# EAGLE schematic kotel (EAGLE 7.7.0)
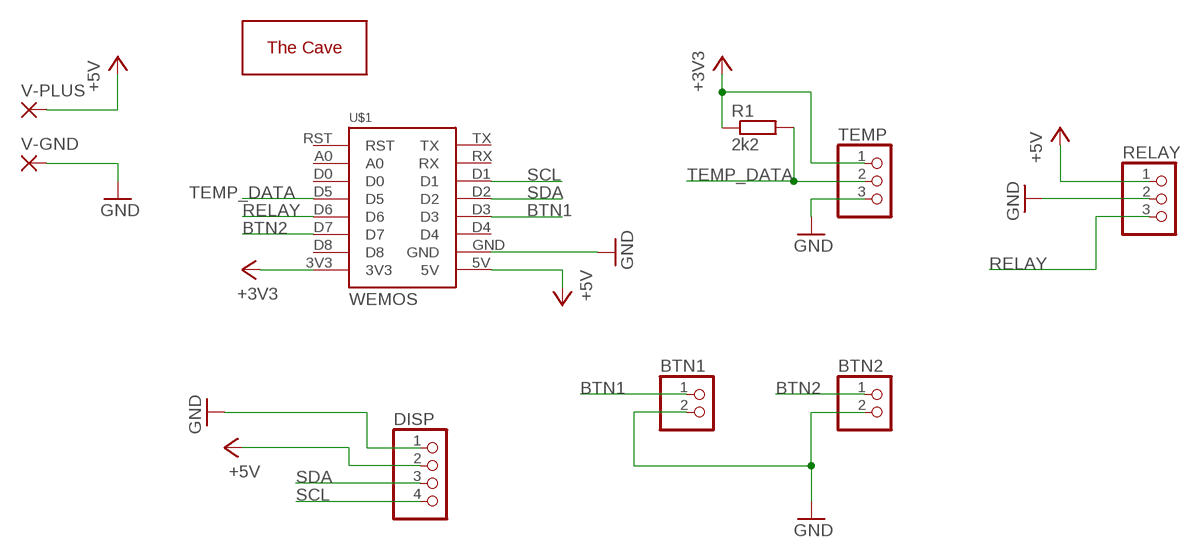
[diagram p0: schematic, sheet 1]

## Parts
BTN1  PINHD-1X2  [1X02]
BTN2  PINHD-1X2  [1X02]
DISP  PINHD-1X4  [1X04]
R1  2k2  R-EU_0207/7  [0207/7]
RELAY  PINHD-1X3  [1X03]
TEMP  PINHD-1X3  [1X03]
U$1  WEMOS  [WEMOS]
U$2  THECAVE_LOGO_COPPER_SMALL  [LOGO_COPPER_SMALL]
V-GND  WIREPAD2,54/0,9  [2,54/0,9]
V-PLUS  WIREPAD2,54/0,9  [2,54/0,9]

## Nets
+3V3: R1.1 TEMP.1 U$1.3V3
+5V: DISP.2 RELAY.1 U$1.5V V-PLUS.1(P)
BTN1: BTN1.1 U$1.D3
BTN2: BTN2.1 U$1.D7
GND: BTN1.2 BTN2.2 DISP.1 RELAY.2 TEMP.3 U$1.GND V-GND.1(P)
RELAY: RELAY.3 U$1.D6
SCL: DISP.4 U$1.D1
SDA: DISP.3 U$1.D2
TEMP_DATA: R1.2 TEMP.2 U$1.D5
Unconnected: U$1.A0 U$1.D0 U$1.D4 U$1.D8 U$1.RST U$1.RX U$1.TX

## Library data of the parts
BTN1 BTN2 = pinhead:PINHD-1X2: PIN HEADER
DISP = pinhead:PINHD-1X4: PIN HEADER
R1 = rcl:R-EU_: RESISTOR, European symbol
RELAY TEMP = pinhead:PINHD-1X3: PIN HEADER
U$1 = d1-mini:WEMOS
U$2 = thecave:THECAVE_LOGO: The Cave DIY workshop logos thecave.cz
V-GND V-PLUS = wirepad:WIREPAD: Wire PAD connect wire on PCB